# Altium schematic sheet Sheet1.SchDoc
size 381 x 300 mm; SheetNumber: 2; SheetTotal: 2
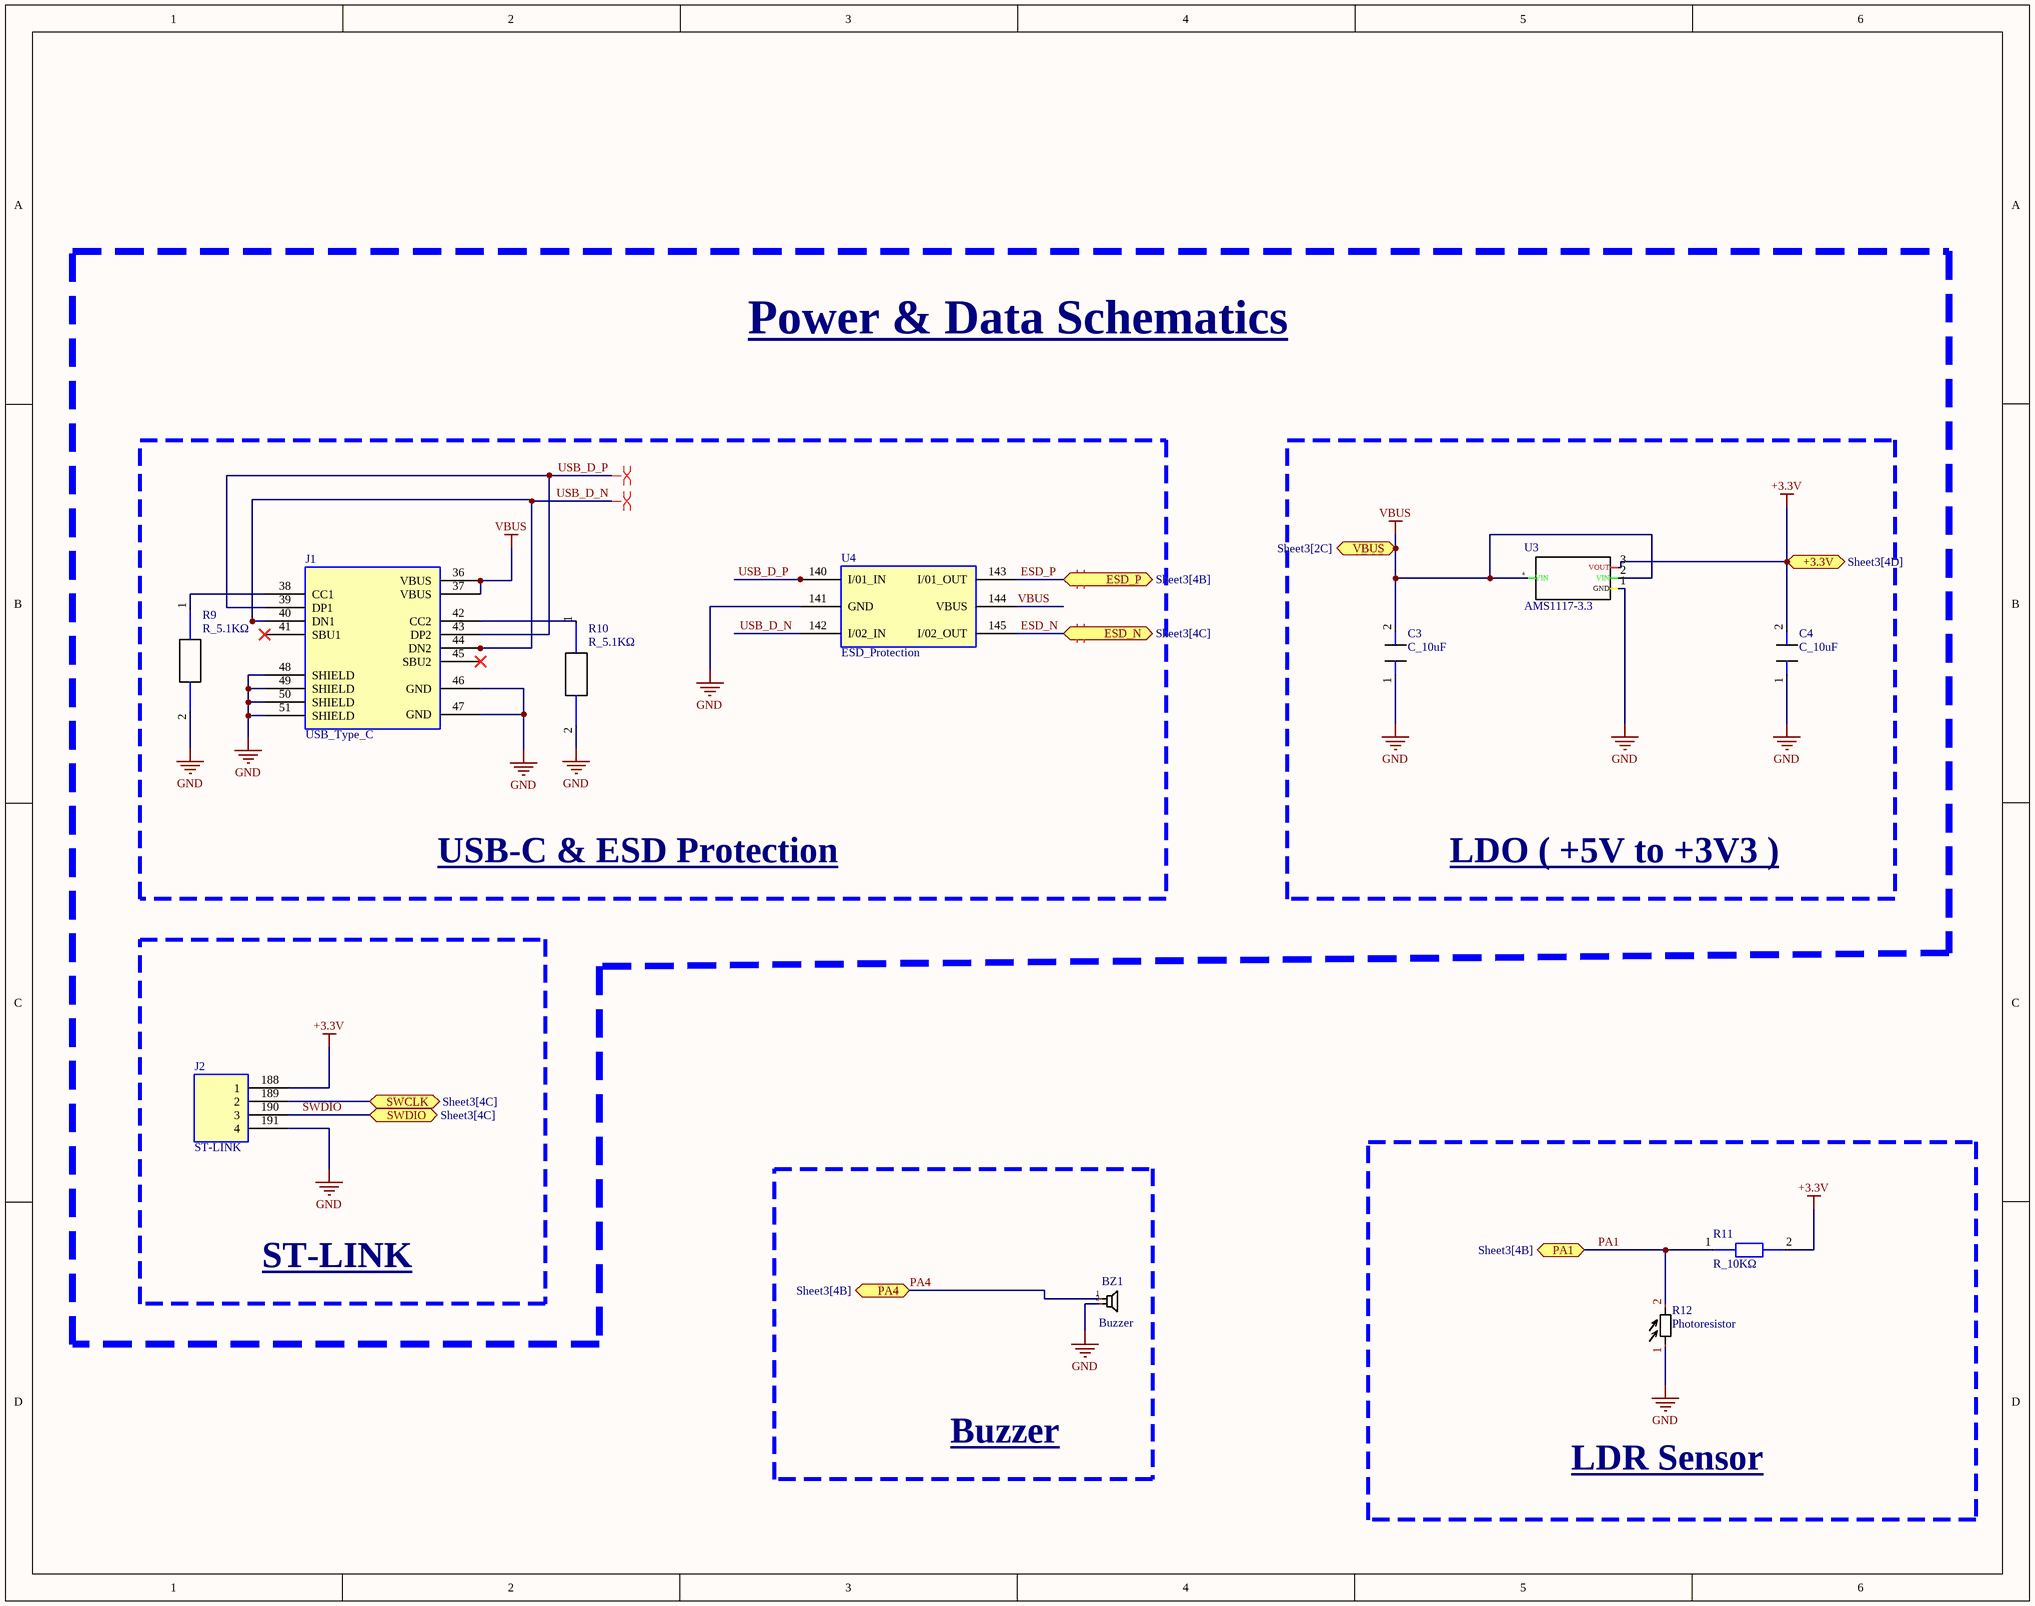
[diagram p0: Sheet1.SchDoc]

## Parts
BZ1  Buzzer  [BUZZER]
C3  C_10uF  [CAP_10uF]
C4  C_10uF  [CAP_10uF]
J1  USB_Type_C  [USB_TYPE_C]
J2  ST-LINK  [4_MALE_HEADER]
R9  R_5.1KΩ  [RES_5.1K]
R10  R_5.1KΩ  [RES_5.1K]
R11  R_10KΩ  [RES_10K]
R12  Photoresistor  [PHOTORESISTOR]
U3  AMS1117-3.3  [AMS1117_3.3V]
U4  ESD_Protection  [ESD_PROTECTION]

## Blocks framed on the sheet
USB-C & ESD Protection: J1 R9 R10 U4
LDO ( +5V to +3V3 ): C3 C4 U3
ST-LINK: J2
Buzzer: BZ1
LDR Sensor: R11 R12

## Ports
+3.3V (bidir, see Sheet3[4D]), ESD_N (bidir, see Sheet3[4C]), ESD_P (bidir, see Sheet3[4B]), PA1 (bidir, see Sheet3[4B]), PA4 (bidir, see Sheet3[4B]), SWCLK (bidir, see Sheet3[4C]), SWDIO (bidir, see Sheet3[4C]), VBUS (bidir, see Sheet3[2C])

## Nets
+3.3V: C4.2 J2.188(1) R11.2 U3.3(VOUT) ; port +3.3V
GND: BZ1.2 C3.1 C4.1 J1.46(GND) J1.47(GND) J1.48(SHIELD) J1.49(SHIELD) J1.50(SHIELD) J1.51(SHIELD) J2.191(4) R9.2 R10.2 R12.1 U3.1(GND) U4.141(GND)
VBUS: C3.2 J1.36(VBUS) J1.37(VBUS) U3.2(VIN) U3.4(VIN) U4.144(VBUS) ; port VBUS
ESD_N: U4.145(I/02_OUT) ; port ESD_N
ESD_P: U4.143(I/01_OUT) ; port ESD_P
PA1: R11.1 R12.2 ; port PA1
PA4: BZ1.1 ; port PA4
SWCLK: J2.189(2) ; port SWCLK
SWDIO: J2.190(3) ; port SWDIO
USB_D_N: J1.40(DN1) J1.44(DN2) U4.142(I/02_IN)
USB_D_P: J1.39(DP1) J1.43(DP2) U4.140(I/01_IN)
NetJ1_38: J1.38(CC1) R9.1
NetJ1_42: J1.42(CC2) R10.1

Not connected (* = marked no-connect by the designer): J1 41(SBU1)* 45(SBU2)*

## Layout directives
differential pair; differential pair class USB_DIFF: USB_D_N, USB_D_P
differential pair; differential pair class ESD_DIFF: ESD_N, ESD_P

## Notes on the sheet
- Power & Data Schematics

## Library data of the parts
BZ1 = Buzzer: Active Buzzer (Built-in Driving Circuit) 2.4kHz 5V Electromagnetic Through Hole,D=12mm Alarms, Buzzers, and Sirens RoHS; MF: CUI; MPU: CMI-1295IC-0585T; Supplier: LCSC; Supplier part #: C6143962; ComponentLink1Description: Datasheet; ComponentLink1URL: https://www.lcsc.com/datasheet/C6143962.pdf?spm=wm.sxq.inf.ggs___wm.fly.bg.26.xh&lcsc_vid=EwQNUwAFEwJeBFwCQlANU10CTwBcVlBTFAMMV1FeQFkxVlNeT1hfV1VeRFhaVDsOAxUeFF5JWBYZEEoKFBINSQcJGk4eFQsCAgIaSgADAwAHC0slRlNdU1RIHxUDCw%3D%3D
C3 C4 = C_10uF: CAP CER 10uF 25V X5R 0805; MFR: Samsung Electro-Mechanics; MFR Part #: CL21A106KAYNNNE; Supplier: LCSC; Supplier Part #: C15850; ComponentLink1Description: Suplpier Part Page; ComponentLink1URL: *
J1 = USB_Type_C: CONN RCPT Type-C 16POS SMD; MFR: Korean Hroparts Elec; MFR Part #: TYPE-C-31-M-12; Supplier: LCSC; Supplier Part #: C165948; ComponentLink1Description: Supplier Part Link; ComponentLink1URL: https://www.lcsc.com/product-detail/C165948.html?s_z=n_q_p_USB%2520type%2520C%2520jack&spm=wm.ssy.bg.1.xh&lcsc_vid=RVdfAQAHTlQNBQIDRgNYVAdUQ1hWXlBRQ1kLVlcDRVkxVlNeQVRbX1xSR1hWXjsOAxUeFF5JWBYZEEoKFBINSQcJGk4dAgUUFAk%3D
J2 = 4_Male_Header: PCB Mount Header, Vertical, Wire-to-Board, 4 Position, 2.54 mm Centerline, Partially Shrouded, Gold, Through Hole - Solder, Signal; MFR: TE Connectivity; MFR Part #: 3-641215-4; Supplier: LCSC; Supplier Part #: C5119032; ComponentLink1Description: Supplier Part Page; ComponentLink1URL: https://www.lcsc.com/product-detail/C5119032.html?s_z=n_q_3-641215-4&spm=wm.fly.bg.0.xh&lcsc_vid=RVdfAQAHTlQNBQIDRgNYVAdUQ1hWXlBRQ1kLVlcDRVkxVlNeQFNcX1FURVRaVzsOAxUeFF5JWBYZEEoKFBINSQcJGk4dAgUUFAk%3D
R9 R10 = R_5.1KΩ: RES 5.1kΩ ±1% 125mW 0805; MFR: UNI-ROYAL; MFR Part #: 0805W8F5101T5E; Supplier: LCSC; Supplier Part #: C27834; ComponentLink1Description: Supplier Part Page; ComponentLink1URL: https://www.lcsc.com/product-detail/C27834.html?s_z=n_q_p_resistor%25205.1K%2520ohm%25200805&spm=wm.ssy.bg.0.xh&lcsc_vid=RVdfAQAHTlQNBQIDRgNYVAdUQ1hWXlBRQ1kLVlcDRVkxVlNeQFBaUVFQRlVeUTsOAxUeFF5JWBYZEEoKFBINSQcJGk4NBhADEA4cHktXRlhXSQwSGg0%3D
R11 = R_10KΩ: RES 10kΩ ±1% 125mW 0805; MFR: FOJAN; MFR Part #: FRC0805F1002TS; Supplier: LCSC; Supplier Part #: C2907219; ComponentLink1Description: Supplier Part Page; ComponentLink1URL: https://www.lcsc.com/product-detail/C2907219.html?s_z=n_q_p_resistor%252010K%2520ohm%25200805&spm=wm.ssy.bg.0.xh&lcsc_vid=RVdfAQAHTlQNBQIDRgNYVAdUQ1hWXlBRQ1kLVlcDRVkxVlNeQFBaUVNST1NfVjsOAxUeFF5JWBYZEEoKFBINSQcJGk4dAgUUFAk%3D
R12 = Photoresistor: 540nm 5kΩ~10kΩ 500kΩ Through Hole,P=3mm Photoresistors; MPN: GL5516; MF: Senba Sensing Tech; Supplier: LCSC; Supplier part #: C125626; ComponentLink1Description: Datasheet; ComponentLink1URL: https://www.lcsc.com/datasheet/C125626.pdf?spm=wm.sxq.inf.ggs___wm.ssy.bg.1.xh&lcsc_vid=E1EMUFFTQQILUVRVRlhaUAYEQ1RWA1RTFlhWXwYAQlkxVlNeT1JYU1dRT1heVTsOAxUeFF5JWBYZEEoKFBINSQcJGk4NBhADEA4cHktQRVVADxALGw%3D%3D
U3 = AMS1117-3.3: 1A Low Dropout (LDO) Regulator; MFU: Advanced Monolithic Systems; MFU part #: AMS1117-3.3; Supplier: LCSC; Supplier part #: C6186; ComponentLink1Description: Datasheet; ComponentLink1URL: https://www.lcsc.com/datasheet/C6187.pdf?spm=wm.sxq.inf.ggs&lcsc_vid=QAQMVlZTQQVfVwJVQgNaVAUDRlAKAlQCTwJdAQVSRFgxVlNeQVZcVFVRRFlWUzsOAxUeFF5JWBYZEEoEHg8JSQcJGk4%3D
U4 = ESD_Protection: ESD DIODE 5.25VWM 17VC SOT-23-6L; MFR: ST; MFR Part #: USBLC6-2SC6; Supplier: LCSC; Supplier Part #: C7519; ComponentLink1Description: Supplier Part Page; ComponentLink1URL: https://www.lcsc.com/product-detail/C7519.html?s_z=s_p_USBLC6-2SC6&spm=wm.fly.bg.0.xh&lcsc_vid=RVdfAQAHTlQNBQIDRgNYVAdUQ1hWXlBRQ1kLVlcDRVkxVlNeQFBaVF1VT1haUTsOAxUeFF5JWBYZEEoKFBINSQcJGk4dAgUUFAk%3D